# Altium project Noise Toaster.PrjPcb (part 1 of 3)
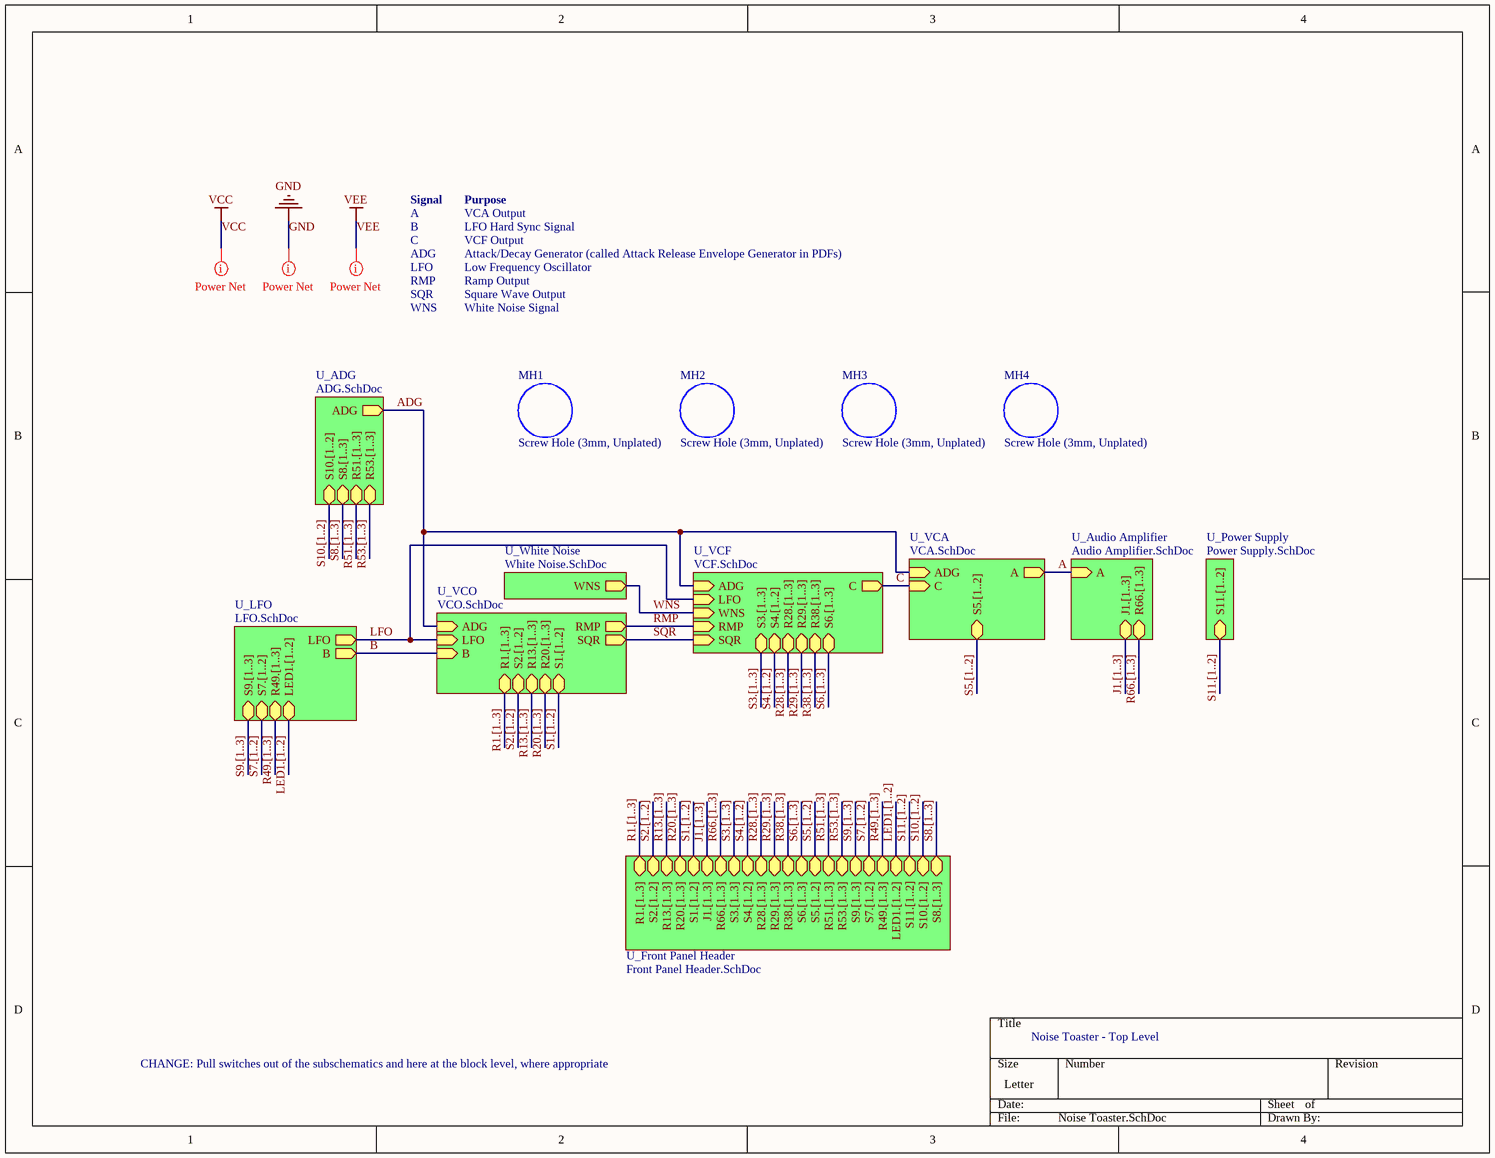
[diagram p0: Noise Toaster.SchDoc]
10 sheets, 135 parts. Net scope: hierarchical (ports join the sheet entries above them; power ports are global).
Board file: Noise Toaster.PcbDoc
Sheets:
  Noise Toaster.SchDoc
    U_Power Supply = Power Supply.SchDoc
    U_White Noise = White Noise.SchDoc
    U_LFO = LFO.SchDoc
    U_ADG = ADG.SchDoc
    U_Audio Amplifier = Audio Amplifier.SchDoc
    U_VCO = VCO.SchDoc
    U_VCF = VCF.SchDoc
    U_VCA = VCA.SchDoc
    U_Front Panel Header = Front Panel Header.SchDoc

## Sheet Noise Toaster.SchDoc: Noise Toaster - Top Level
size Letter; SheetNumber: 1; SheetTotal: 10

### Parts
MH1  Screw Hole (3mm, Unplated)  [SCREW HOLE (3MM, UNPLATED)]
MH2  Screw Hole (3mm, Unplated)  [SCREW HOLE (3MM, UNPLATED)]
MH3  Screw Hole (3mm, Unplated)  [SCREW HOLE (3MM, UNPLATED)]
MH4  Screw Hole (3mm, Unplated)  [SCREW HOLE (3MM, UNPLATED)]

### Sub-sheets
U_ADG = ADG.SchDoc: ADG (out), S10.[1..2] (bidir), S8.[1..3] (bidir), R51.[1..3] (bidir), R53.[1..3] (bidir)
U_Audio Amplifier = Audio Amplifier.SchDoc: A (in), J1.[1..3] (bidir), R66.[1..3] (bidir)
U_Front Panel Header = Front Panel Header.SchDoc: S5.[1..2] (bidir), R1.[1..3] (bidir), S2.[1..2] (bidir), R13.[1..3] (bidir), R20.[1..3] (bidir), S1.[1..2] (bidir), J1.[1..3] (bidir), R66.[1..3] (bidir), S3.[1..3] (bidir), S4.[1..2] (bidir), R28.[1..3] (bidir), R29.[1..3] (bidir), R38.[1..3] (bidir), S6.[1..3] (bidir), R51.[1..3] (bidir), R53.[1..3] (bidir), S9.[1..3] (bidir), S7.[1..2] (bidir), R49.[1..3] (bidir), LED1.[1..2] (bidir), S11.[1..2] (bidir), S10.[1..2] (bidir), S8.[1..3] (bidir)
U_LFO = LFO.SchDoc: LFO (out), B (out), S9.[1..3] (bidir), S7.[1..2] (bidir), R49.[1..3] (bidir), LED1.[1..2] (bidir)
U_Power Supply = Power Supply.SchDoc: S11.[1..2] (bidir)
U_VCA = VCA.SchDoc: A (out), C (in), ADG (in), S5.[1..2] (bidir)
U_VCF = VCF.SchDoc: SQR (in), RMP (in), WNS (in), LFO (in), ADG (in), C (out), S3.[1..3] (bidir), S4.[1..2] (bidir), R28.[1..3] (bidir), R29.[1..3] (bidir), R38.[1..3] (bidir), S6.[1..3] (bidir)
U_VCO = VCO.SchDoc: LFO (in), ADG (in), B (in), RMP (out), SQR (out), R1.[1..3] (bidir), S2.[1..2] (bidir), R13.[1..3] (bidir), R20.[1..3] (bidir), S1.[1..2] (bidir)
U_White Noise = White Noise.SchDoc: WNS (out)

### Nets
A: sheet U_Audio Amplifier/A, sheet U_VCA/A
ADG: sheet U_ADG/ADG, sheet U_VCO/ADG, sheet U_VCF/ADG, sheet U_VCA/ADG
B: sheet U_LFO/B, sheet U_VCO/B
C: sheet U_VCF/C, sheet U_VCA/C
LFO: sheet U_LFO/LFO, sheet U_VCO/LFO, sheet U_VCF/LFO
RMP: sheet U_VCO/RMP, sheet U_VCF/RMP
SQR: sheet U_VCO/SQR, sheet U_VCF/SQR  [project net S3.3]
WNS: sheet U_White Noise/WNS, sheet U_VCF/WNS  [project net S4.1]

### Buses and harness runs
bus J1.[1..3] = sheet U_Audio Amplifier/J1.[1..3]
bus J1.[1..3] = sheet U_Front Panel Header/J1.[1..3]
bus LED1.[1..2] = sheet U_Front Panel Header/LED1.[1..2]
bus LED1.[1..2] = sheet U_LFO/LED1.[1..2]
bus R1.[1..3] = sheet U_Front Panel Header/R1.[1..3]
bus R1.[1..3] = sheet U_VCO/R1.[1..3]
bus R13.[1..3] = sheet U_Front Panel Header/R13.[1..3]
bus R13.[1..3] = sheet U_VCO/R13.[1..3]
bus R20.[1..3] = sheet U_Front Panel Header/R20.[1..3]
bus R20.[1..3] = sheet U_VCO/R20.[1..3]
bus R28.[1..3] = sheet U_Front Panel Header/R28.[1..3]
bus R28.[1..3] = sheet U_VCF/R28.[1..3]
bus R29.[1..3] = sheet U_Front Panel Header/R29.[1..3]
bus R29.[1..3] = sheet U_VCF/R29.[1..3]
bus R38.[1..3] = sheet U_Front Panel Header/R38.[1..3]
bus R38.[1..3] = sheet U_VCF/R38.[1..3]
bus R49.[1..3] = sheet U_Front Panel Header/R49.[1..3]
bus R49.[1..3] = sheet U_LFO/R49.[1..3]
bus R51.[1..3] = sheet U_ADG/R51.[1..3]
bus R51.[1..3] = sheet U_Front Panel Header/R51.[1..3]
bus R53.[1..3] = sheet U_ADG/R53.[1..3]
bus R53.[1..3] = sheet U_Front Panel Header/R53.[1..3]
bus R66.[1..3] = sheet U_Audio Amplifier/R66.[1..3]
bus R66.[1..3] = sheet U_Front Panel Header/R66.[1..3]
bus S1.[1..2] = sheet U_Front Panel Header/S1.[1..2]
bus S1.[1..2] = sheet U_VCO/S1.[1..2]
bus S2.[1..2] = sheet U_Front Panel Header/S2.[1..2]
bus S2.[1..2] = sheet U_VCO/S2.[1..2]
bus S3.[1..3] = sheet U_Front Panel Header/S3.[1..3]
bus S3.[1..3] = sheet U_VCF/S3.[1..3]
bus S4.[1..2] = sheet U_Front Panel Header/S4.[1..2]
bus S4.[1..2] = sheet U_VCF/S4.[1..2]
bus S5.[1..2] = sheet U_Front Panel Header/S5.[1..2]
bus S5.[1..2] = sheet U_VCA/S5.[1..2]
bus S6.[1..3] = sheet U_Front Panel Header/S6.[1..3]
bus S6.[1..3] = sheet U_VCF/S6.[1..3]
bus S7.[1..2] = sheet U_Front Panel Header/S7.[1..2]
bus S7.[1..2] = sheet U_LFO/S7.[1..2]
bus S8.[1..3] = sheet U_ADG/S8.[1..3]
bus S8.[1..3] = sheet U_Front Panel Header/S8.[1..3]
bus S9.[1..3] = sheet U_Front Panel Header/S9.[1..3]
bus S9.[1..3] = sheet U_LFO/S9.[1..3]
bus S10.[1..2] = sheet U_ADG/S10.[1..2]
bus S10.[1..2] = sheet U_Front Panel Header/S10.[1..2]
bus S11.[1..2] = sheet U_Front Panel Header/S11.[1..2]
bus S11.[1..2] = sheet U_Power Supply/S11.[1..2]

### Layout directives
net class POWER; rule Width Constraint [Pref Width = 20mil    Min Width = 10mil    Max Width = 20mil]: GND, VCC, VEE

### Notes on the sheet
- Signal
- A
- B
- Purpose
- VCA Output
- LFO Hard Sync Signal
- C
- ADG
- LFO
- RMP
- SQR
- VCF Output
- Attack/Decay Generator (called Attack Release Envelope Generator in PDFs)
- Low Frequency Oscillator
- Ramp Output
- Square Wave Output
- WNS
- White Noise Signal
- CHANGE: Pull switches out of the subschematics and here at the block level, where appropriate

### Library data of the parts
MH1-MH4 = Screw Hole (3mm, Unplated): 3mm unplated plus washer keepout

## Sheet Power Supply.SchDoc: Power Supply
size Letter; SheetNumber: 6; SheetTotal: 10
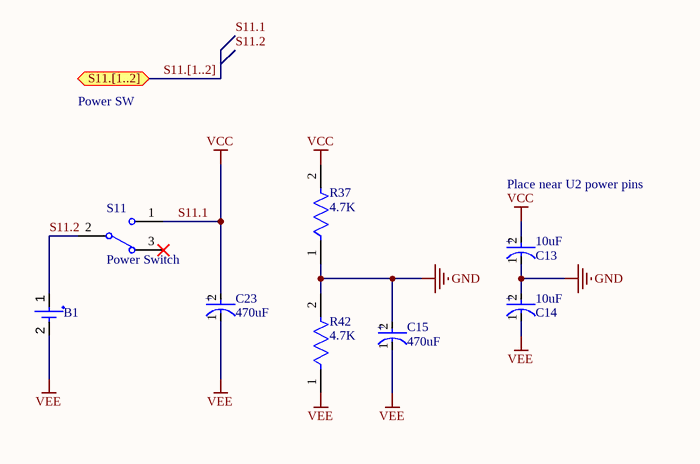
[diagram p1: Power Supply.SchDoc]

### Parts
B1  (no value)  [HDR1X2]
C13  Capacitance: 10uF  [FP-OS-CON-SMT-A5-MFG]  (hidden comment: 865080440002)
C14  Capacitance: 10uF  [FP-OS-CON-SMT-A5-MFG]  (hidden comment: 865080440002)
C15  Capacitance: 470uF  [FP-FTF-MFG]
C23  Capacitance: 470uF  [FP-FTF-MFG]
R37  Resistance: 4.7K  [FP-ESR03-IPC_B]  (hidden comment: ESR03EZPJ472)
R42  Resistance: 4.7K  [FP-ESR03-IPC_B]  (hidden comment: ESR03EZPJ472)
S11  Power Switch  [HDR1X3]

### Ports
S11.[1..2] (bidir)

### Nets
GND: C13.1(C) C14.2(A) C15.2(A) R37.1 R42.2
VCC: C13.2(A) C23.2(A) R37.2 S11.1  [also labelled S11.1]
VEE: B1.2(-) C14.1(C) C15.1(C) C23.1(C) R42.1
S11.2: B1.1(+) S11.2

Not connected (* = marked no-connect by the designer): S11 3*

### Buses and harness runs
bus S11.[1..2] = port S11.[1..2]

### Notes on the sheet
- Power SW
- (near C13) Place near U2 power pins
- Labels drawn without touching a wire or pin: S11.1, S11.2
- (in symbol CMP-05427-000040-1) +
- (in symbol CMP-05427-000158-1) +

### Library data of the parts
B1 = CMP-00622-2: Hldr, Battery, PP3 (6R61), Phospher Bronze, Tin, Panel Mount, 1, Solder Lug; Manufacturer: Bulgin; Manufacturer Part Number: BX0023; Body Material: Nylon,Glass,Bronze; Number of Cells: 1; Supplier 1: Arrow Electronics; Supplier Part Number 1: BX0023; RoHS: Yes; Category: Batteries and Accessories; Stock 1: 80; Pricing 1: 1=11.73100, 10=9.42900, 50=8.50000, 100=7.93600, 250=7.25000, 500=6.86300, 1000=6.28900 (USD); Mount: Panel,Screw; Contact Material: Bronze,Tin; Contact Plating: Tin; Material: Nylon,Glass; Min Operating Temperature: -30°C; Max Operating Temperature: 70°C; Package Quantity: 50; Termination: Solder; Number of Batteries: 1; Packaging: Bulk; Series: BX; REACH SVHC: No SVHC; Flammability Rating: UL94 V-0; RoHS Compliant: Yes; ComponentLink1URL: https://datasheet.ciiva.com/1390/bulgin-2010-p9-1390970.pdf?src-supplier=Element14; ComponentLink1Description: https://datasheet.ciiva.com/1390/bulgin-2010-p9-1390970.pdf?src-supplier=Element14; ComponentLink2URL: https://datasheet.ciiva.com/11714/0900766b80d05969-11714722.pdf?src-supplier=RSComponents; ComponentLink2Description: https://datasheet.ciiva.com/11714/0900766b80d05969-11714722.pdf?src-supplier=RSComponents; ComponentLink3URL: https://datasheet.ciiva.com/3/battholders-2010-3898.pdf?src-supplier=Digi-Key; ComponentLink3Description: https://datasheet.ciiva.com/3/battholders-2010-3898.pdf?src-supplier=Digi-Key; ComponentLink4URL: https://datasheet.ciiva.com/3353/06951396-3353149.pdf?src-supplier=Distrelec; ComponentLink4Description: https://datasheet.ciiva.com/3353/06951396-3353149.pdf?src-supplier=Distrelec; ComponentLink5URL: https://datasheet.ciiva.com/25759/70099004-25759926.pdf?src-supplier=Allied+Electronics; ComponentLink5Description: https://datasheet.ciiva.com/25759/70099004-25759926.pdf?src-supplier=Allied+Electronics; ComponentLink6URL: https://datasheet.ciiva.com/24336/battholders2005-24336774.pdf?src-supplier=Onlinecomponents.com; ComponentLink6Description: https://datasheet.ciiva.com/24336/battholders2005-24336774.pdf?src-supplier=Onlinecomponents.com
C13 C14 = CMP-05427-000158-1: CAP ALUM POLY 10UF 20% 10V SMD; Manufacturer: Wurth Electronics; Voltage Rating: 25V; Polarity: Polar; Ripple Current: 85mA; Impedance: 2.1R; Life (Hours): 2000Hour; Supplier 1: RSComponents; Supplier Part Number 1: 8391799P; Manufacturer Part Number: 865080440002; RoHS: Yes; Category: Aluminum Electrolytic Capacitors; Stock 1: 1; Pricing 1: 25=0.18500, 125=0.12700, 250=0.11600, 500=0.10400 (USD); Mount: Surface Mount; Case/Package: Radial; Min Operating Temperature: -55°C; Max Operating Temperature: 105°C; Package Quantity: 2000; Packaging: Cut Tape; Ripple Current (AC): 85mA; Tolerance: 20%; Voltage Rating (DC): 25V; Diameter: 4mm; Height: 5.5mm; Height - Seated (Max): 0.217inch; REACH SVHC: Unknown; RoHS Compliant: Yes; ComponentLink1URL: http://www.farnell.com/datasheets/1880137.pdf?src-supplier=Farnell; ComponentLink1Description: http://www.farnell.com/datasheets/1880137.pdf?src-supplier=Farnell; ComponentLink2URL: http://www.farnell.com/datasheets/1880137.pdf?src-supplier=Element14; ComponentLink2Description: http://www.farnell.com/datasheets/1880137.pdf?src-supplier=Element14; ComponentLink3URL: https://katalog.we-online.de/pbs/datasheet/865080440002.pdf?src-supplier=Digi-Key; ComponentLink3Description: https://katalog.we-online.de/pbs/datasheet/865080440002.pdf?src-supplier=Digi-Key; ComponentLink4URL: http://katalog.we-online.de/pbs/datasheet/865080440002.pdf?src-supplier=Digi-Key; ComponentLink4Description: http://katalog.we-online.de/pbs/datasheet/865080440002.pdf?src-supplier=Digi-Key
C15 C23 = CMP-05427-000040-1: Manufacturer: Wurth Electronics; Manufacturer Part Number: 865080353015; Voltage Rating: 16V; Polarity: Polar; Ripple Current: 590mA; Impedance: 220mR; Life (Hours): 2000Hour; Tolerance: 20%; Supplier 1: Digi-Key; Supplier Part Number 1: 732-8425-1-ND; RoHS: Yes; Category: Aluminum Electrolytic Capacitors; Stock 1: 263; Pricing 1: 1=0.63000, 50=0.53700, 100=0.46700, 250=0.41600 (USD); Mount: Surface Mount; Case/Package: Radial; Min Operating Temperature: -55°C; Max Operating Temperature: 105°C; Package Quantity: 500; Packaging: Cut Tape; Ripple Current (AC): 590mA; Voltage Rating (DC): 16V; Diameter: 8mm; Height: 10.5mm; Height - Seated (Max): 0.413inch; REACH SVHC: Unknown; RoHS Compliant: Yes; ComponentLink1URL: http://www.farnell.com/datasheets/1880132.pdf?src-supplier=Farnell; ComponentLink1Description: http://www.farnell.com/datasheets/1880132.pdf?src-supplier=Farnell; ComponentLink2URL: http://www.farnell.com/datasheets/1880132.pdf?src-supplier=Element14; ComponentLink2Description: http://www.farnell.com/datasheets/1880132.pdf?src-supplier=Element14; ComponentLink3URL: https://katalog.we-online.de/pbs/datasheet/865080353015.pdf?src-supplier=Digi-Key; ComponentLink3Description: https://katalog.we-online.de/pbs/datasheet/865080353015.pdf?src-supplier=Digi-Key; ComponentLink4URL: http://katalog.we-online.de/pbs/datasheet/865080353015.pdf?src-supplier=Digi-Key; ComponentLink4Description: http://katalog.we-online.de/pbs/datasheet/865080353015.pdf?src-supplier=Digi-Key
R37 R42 = CMP-08839-007853-1: 4.7kΩ ±5% 0.25W 0603 Anti-Surge Chip Resistor AEC-Q200; Max Power Dissipation: 250mW; Temperature Coefficient: 200ppm/°C; Packaging: Tape and Reel; Series: ESR; Height: 0.022inch; Case Code (Imperial): 0603; Tolerance: 5%; RoHS Compliant: Yes; Case/Package: 0603; Min Operating Temperature: -55°C; Resistor Type: Thick Film; Package Quantity: 5000; Features: Automotive AEC-Q200; Width: 0.031inch; Length: 0.063inch; Max Operating Temperature: 155°C; Number of Terminations: 2
S11 = SW-SPDT: Switch Toggle ON None ON SPDT Round Lever Solder Lug 5A 250VAC 28VDC Panel Mount with Threads; Manufacturer: E-Switch; Manufacturer Part Number: 100SP1T1B1M1QEH; Actuator Material: Brass,Chrome; Actuator Color: Chrome; Voltage Rating (AC): 120V; Voltage Rating (DC): 28V; Max Voltage Rating (AC): 250V; Illumination Type: Illuminated,Non-Illuminated; Switch Function: On-On; Actuator Type: Standard Round; Contact Resistance: 100mR; Electrical Life: 40000Cycles; Actuator Length: 10.41mm; Supplier 1: Newark; Supplier Part Number 1: 15N9971; RoHS: Yes; Category: Toggle Switches; Stock 1: 978; Pricing 1: 1=3.08000, 10=2.76000, 25=2.61000, 50=2.49000, 100=2.37000 (USD); Mount: Panel; Contact Material: Copper Alloy,Silver; Contact Plating: Silver; Housing Material: Stainless Steel; Min Operating Temperature: -30°C; Max Operating Temperature: 85°C; Throw Configuration: SPDT; Current Rating: 5A; Package Quantity: 1; Packaging: Bulk; Max Voltage Rating (DC): 28V; Termination: Solder; Orientation: Straight; Series: 100; REACH SVHC: No SVHC; Lead Free: Lead Free; RoHS Compliant: Yes; ComponentLink1URL: https://datasheet.ciiva.com/2904/st110007c-2904798.pdf?src-supplier=Digi-Key; ComponentLink1Description: https://datasheet.ciiva.com/2904/st110007c-2904798.pdf?src-supplier=Digi-Key; ComponentLink2URL: https://datasheet.ciiva.com/16154/xt0157p-16154561.pdf?src-supplier=Onlinecomponents.com; ComponentLink2Description: https://datasheet.ciiva.com/16154/xt0157p-16154561.pdf?src-supplier=Onlinecomponents.com; ComponentLink3URL: https://datasheet.ciiva.com/16347/100-16347391.pdf?src-supplier=Future+Electronics; ComponentLink3Description: https://datasheet.ciiva.com/16347/100-16347391.pdf?src-supplier=Future+Electronics

## Sheet White Noise.SchDoc: White Noise Generator
size Letter; SheetNumber: 10; SheetTotal: 10
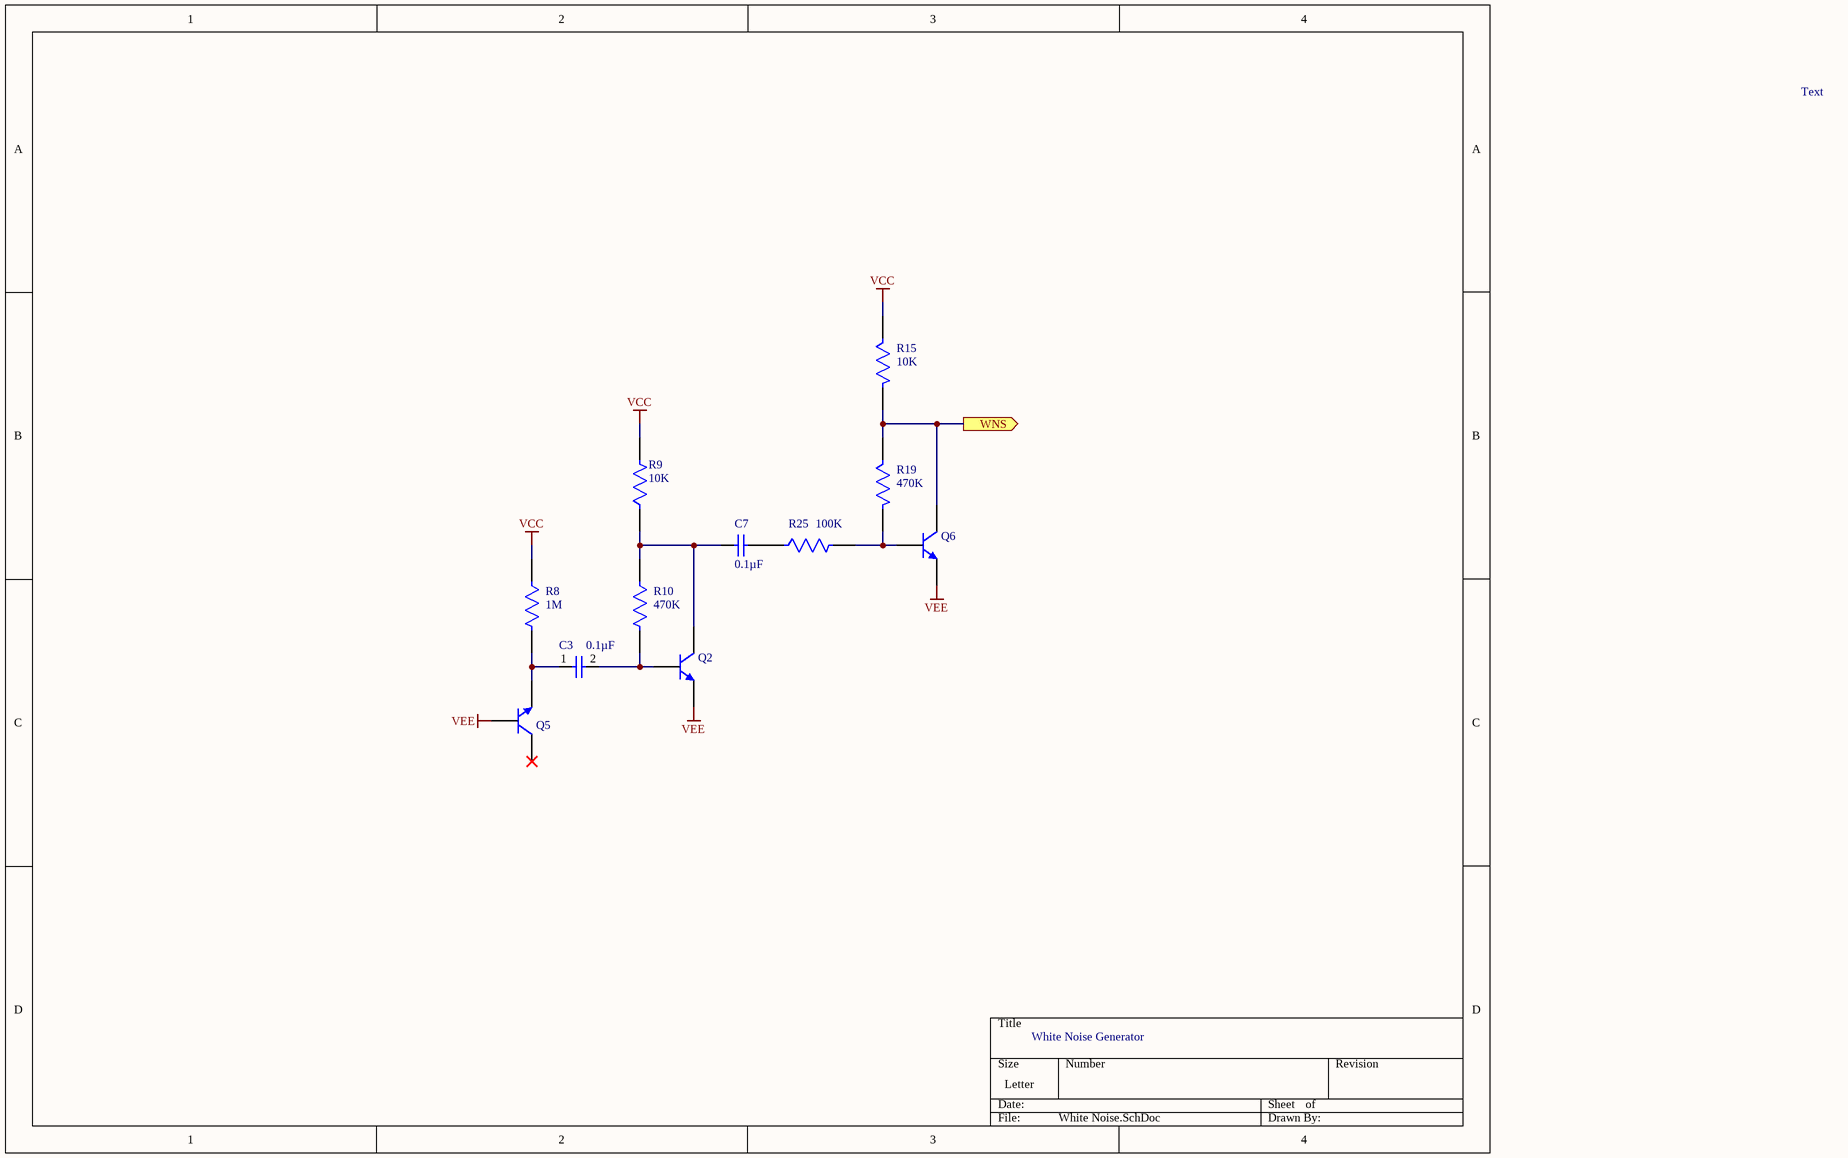
[diagram p2: White Noise.SchDoc]

### Parts
C3  Capacitance: 0.1µF  [SAMS-C0603-2_M]  (hidden comment: CL10B104KB8NNNC)
C7  Capacitance: 0.1µF  [SAMS-C0603-2_M]  (hidden comment: CL10B104KB8NNNC)
Q2  MMBT3904LT1G  [ONSC-SOT-23-3-318-08_V]  (value not drawn)
Q5  MMBT3904LT1G  [ONSC-SOT-23-3-318-08_V]  (value not drawn)
Q6  MMBT3904LT1G  [ONSC-SOT-23-3-318-08_V]  (value not drawn)
R8  Resistance: 1M  [FP-ESR03-IPC_B]  (hidden comment: ESR03EZPJ105)
R9  Resistance: 10K  [FP-ESR03-IPC_B]  (hidden comment: ESR03EZPJ103)
R10  Resistance: 470K  [FP-ESR03-IPC_B]  (hidden comment: ESR03EZPJ474)
R15  Resistance: 10K  [FP-ESR03-IPC_B]  (hidden comment: ESR03EZPJ103)
R19  Resistance: 470K  [FP-ESR03-IPC_B]  (hidden comment: ESR03EZPJ474)
R25  Resistance: 100K  [FP-ESR03-IPC_B]  (hidden comment: ESR03EZPJ104)

### Ports
WNS (out)

### Nets
VCC: R8.1 R9.2 R15.1
VEE: Q2.2(E) Q5.1(B) Q6.2(E)
S4.1: Q6.3(C) R15.2 R19.1 ; port WNS
NetC3_1: C3.1 Q5.2(E) R8.2
NetC3_2: C3.2 Q2.1(B) R10.2
NetC7_1: C7.1 R25.1
NetC7_2: C7.2 Q2.3(C) R9.1 R10.1
NetQ6_1: Q6.1(B) R19.2 R25.2

Not connected (* = marked no-connect by the designer): Q5 3(C)*

### Notes on the sheet
- Text

### Library data of the parts
C3 C7 = CMP-2000-05332-1: Multi-layer Ceramic Capacitor, -55 to 125 degC, 2-Pin SMD (0603), RoHS, Tape and Reel; Manufacturer: Samsung Electro-Mechanics; Rated Voltage: 50V; Dielectric: X7R; Tolerance (%): ±10%; Case Size/Dimension: 0603; Datasheet URL: https://datasheet.ciiva.com/29198/456651-da-01-en-vs-kondensator-0605-29198839.pdf; Manufacturer URL: http://www.samsungsem.com/global/index.jsp; Datasheet Version: Nov-10
Q2 Q5 Q6 = CMP-1048-00631-1: General Purpose Transistor, NPN Silicon, 3-Pin SOT-23, Pb-Free, Tape and Reel; Manufacturer: On Semiconductor; Manufacturer Part Number: MMBT3904,215; IC Continuous (A): 0.2; fT Min (MHz): 300; ComponentLink2Description: Datasheet; Polarity: NPN; PackageDescription: 3-Pin Small Outline Transistor, Body 2.92 x 1.3 mm, Pitch 0.95 mm; ComponentLink2URL: http://www.onsemi.cn/pub_link/Collateral/MMBT3904LT1-D.PDF; DatasheetVersion: Rev. 12; Mounting Technology: Surface Mount; PartNumber: MMBT3904LT1G; ComponentLink1URL: http://www.onsemi.com/; ComponentLink3Description: Package Specification; ComponentLink1Description: Manufacturer URL; PackageVersion: Rev. AP, 11/2009; PackageReference: SOT-23-3-318-08; Packing: Tape and Reel; ComponentLink3URL: http://www.onsemi.cn/pub_link/Collateral/318-08.PDF; RoHS: TRUE; Supplier 1: Digi-Key; Supplier Part Number 1: 1727-4044-1-ND; Category: BJTs; Stock 1: 165643; Pricing 1: 1=0.10000, 10=0.06500, 25=0.06200, 100=0.03500, 500=0.02750, 1000=0.01910 (USD); RoHS Compliant: Yes; ComponentLink4URL: http://www.farnell.com/datasheets/2328888.pdf?src-supplier=Farnell; ComponentLink4Description: http://www.farnell.com/datasheets/2328888.pdf?src-supplier=Farnell; ComponentLink5URL: https://assets.nexperia.com/documents/data-sheet/MMBT3904.pdf?src-supplier=Digi-Key; ComponentLink5Description: https://assets.nexperia.com/documents/data-sheet/MMBT3904.pdf?src-supplier=Digi-Key; ComponentLink6URL: http://www.farnell.com/datasheets/2328888.pdf?src-supplier=Newark; ComponentLink6Description: http://www.farnell.com/datasheets/2328888.pdf?src-supplier=Newark
R8 = CMP-08839-029147-1: 1MΩ ±5% 0.25W 0603 Anti-Surge Chip Resistor AEC-Q200; Max Power Dissipation: 250mW; Temperature Coefficient: 200ppm/°C; Width: 0.031inch; Package Quantity: 1; Case/Package: 0603; Features: Automotive AEC-Q200; Packaging: Cut Tape; Case Code (Metric): 1608; Number of Terminations: 2; Series: ESR; Max Operating Temperature: 155°C; Resistor Type: Thick Film; RoHS Compliant: Yes; Min Operating Temperature: -55°C; Height: 0.022inch; Length: 0.063inch; Tolerance: 5%; Case Code (Imperial): 0603
R9 R15 = CMP-08839-028975-1: 10kΩ ±5% 0.25W 0603 Anti-Surge Chip Resistor AEC-Q200; Power Rating: 250mW; Temperature Coefficient: 200ppm/°C; Tolerance: 5%; Series: ESR03; Package Quantity: 5000; Length: 0.063inch; Height: 0.022inch; Lead Free: Lead Free; Case/Package: 0603; Case Code (Metric): 1608; Width: 0.031inch; Resistor Type: Thick Film; Max Power Dissipation: 250mW; Packaging: Tape and Reel; Mount: Surface Mount; Number of Terminations: 2; Case Code (Imperial): 0603; Max Operating Temperature: 155°C; Min Operating Temperature: -55°C; RoHS Compliant: Yes
R10 R19 = CMP-08839-028761-1: 470kΩ ±5% 0.25W 0603 Anti-Surge Chip Resistor AEC-Q200; Temperature Coefficient: 200ppm/°C; Max Power Dissipation: 250mW; RoHS Compliant: Yes; Packaging: Cut Tape; Max Operating Temperature: 155°C; Package Quantity: 5000; Resistor Type: Thick Film; Min Operating Temperature: -55°C; Number of Terminations: 2; Features: Automotive AEC-Q200; Tolerance: 5%; Width: 0.031inch; Case Code (Metric): 1608; Length: 0.063inch; Case/Package: 0603; Height: 0.022inch; Case Code (Imperial): 0603; Series: ESR
R25 = CMP-08839-029521-1: 100kΩ ±5% 0.25W 0603 Anti-Surge Chip Resistor AEC-Q200; Power Rating: 200mW; Max Power Dissipation: 250mW; Temperature Coefficient: 200ppm/°C; Length: 0.063inch; Case Code (Imperial): 0603; Case/Package: 0603; Resistor Type: Thick Film; Features: Automotive AEC-Q200; Package Quantity: 1; Width: 0.031inch; Packaging: Cut Tape; Min Operating Temperature: -55°C; Series: ESR; RoHS Compliant: Yes; Size Code: 0603; Tolerance: 5%; Height: 0.022inch; Max Operating Temperature: 155°C; Lead Free: Lead Free; Case Code (Metric): 1608; Number of Terminations: 2

## Sheet LFO.SchDoc: Low Frequency Oscillator
size Letter; SheetNumber: 5; SheetTotal: 10
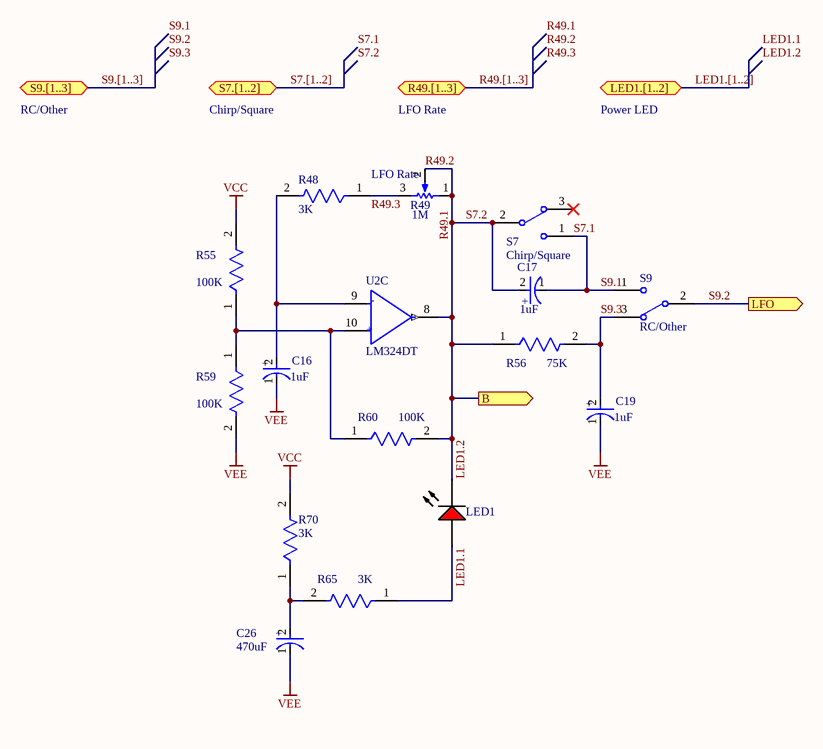
[diagram p3: LFO.SchDoc]

### Parts
C16  Capacitance: 1uF  [FP-OS-CON-SMT-A5-MFG]  (hidden comment: ‎865060640001‎)
C17  Capacitance: 1uF  [FP-OS-CON-SMT-A5-MFG]  (hidden comment: EEE-1HA010NR)
C19  Capacitance: 1uF  [FP-OS-CON-SMT-A5-MFG]  (hidden comment: ‎865060640001‎)
C26  Capacitance: 470uF  [FP-FTF-MFG]
LED1  C503B-RAN-CY0B0AA2  [CREE-C503B-RAN]  (value not drawn)  (graphical)
R48  Resistance: 3K  [FP-ESR03-IPC_B]  (hidden comment: ESR03EZPJ302)
R49  LFO Rate  value 1M  [VR5]  (graphical)
R55  Resistance: 100K  [FP-ESR03-IPC_B]  (hidden comment: ESR03EZPJ104)
R56  Resistance: 75K  [FP-ESR03-IPC_B]  (hidden comment: ESR03EZPJ753)
R59  Resistance: 100K  [FP-ESR03-IPC_B]  (hidden comment: ESR03EZPJ104)
R60  Resistance: 100K  [FP-ESR03-IPC_B]  (hidden comment: ESR03EZPJ104)
R65  Resistance: 3K  [FP-ESR03-IPC_B]  (hidden comment: ESR03EZPJ302)
R70  Resistance: 3K  [FP-ESR03-IPC_B]  (hidden comment: ESR03EZPJ302)
S7  Chirp/Square  [HDR1X3]
S9  RC/Other  [HDR1X3]  (graphical)
U2  LM324DT  [FP-SO-14-MFG]  (part C of 4)

### Ports
B (out), LED1.[1..2] (bidir), LFO (out), R49.[1..3] (bidir), S7.[1..2] (bidir), S9.[1..3] (bidir)

### Nets
VCC: R55.2 R70.2
VEE: C16.1(C) C19.1(C) C26.1(C) R59.2
LED1.1: LED1.1(A) R65.1
LED1.2: C17.2(A) LED1.2(K) R49.1(TOP) R49.2(TAP) R56.1 R60.2 S7.2 U2.8(Output_3) ; port B  [also labelled R49.1, R49.2, S7.2]  [project net B]
R49.3: R48.1 R49.3(BOT)
S7.1: C17.1(C) S7.1 S9.1  [also labelled S9.1]
S9.2: S9.2 ; port LFO  [project net LFO]
S9.3: C19.2(A) R56.2 S9.3
NetC16_2: C16.2(A) R48.2 U2.9(Inverting_Input_3)
NetC26_2: C26.2(A) R65.2 R70.1
NetR55_1: R55.1 R59.1 R60.1 U2.10(Non-Inverting_Input_3)

Not connected (* = marked no-connect by the designer): S7 3*

### Buses and harness runs
bus LED1.[1..2] = port LED1.[1..2]
bus R49.[1..3] = port R49.[1..3]
bus S7.[1..2] = port S7.[1..2]
bus S9.[1..3] = port S9.[1..3]

### Notes on the sheet
- RC/Other
- Chirp/Square
- LFO Rate
- Power LED
- Labels drawn without touching a wire or pin: LED1.1, LED1.2, R49.1, R49.2, R49.3, S7.1, S7.2, S9.1, S9.2, S9.3
- (in symbol CMP-05427-000040-1) +
- (in symbol CMP-05427-000158-1) +
- (in symbol CMP-12131-000005-1, part C) -; +

### Library data of the parts
C16 C19 = CMP-05427-000158-1: Manufacturer: Wurth Electronics; Voltage Rating: 50V; Polarity: Polar; Ripple Current: 60mA; Impedance: 2.9R; Life (Hours): 2000Hour; Tolerance: 20%; Supplier 1: RSComponents; Supplier Part Number 1: 8395602; Manufacturer Part Number: 865060640001; RoHS: Yes; Category: Aluminum Electrolytic Capacitors; Stock 1: 1; Pricing 1: 25=0.16200, 125=0.11600, 250=0.10400, 500=0.09300 (USD); Mount: Surface Mount; Case/Package: Radial; Min Operating Temperature: -55°C; Max Operating Temperature: 105°C; Package Quantity: 2000; Packaging: Cut Tape; Ripple Current (AC): 60mA; Voltage Rating (DC): 50V; Diameter: 4mm; Height: 5.5mm; Height - Seated (Max): 0.217inch; REACH SVHC: Unknown; ComponentLink1URL: http://www.farnell.com/datasheets/1880069.pdf?src-supplier=Farnell; ComponentLink1Description: http://www.farnell.com/datasheets/1880069.pdf?src-supplier=Farnell; ComponentLink2URL: http://www.farnell.com/datasheets/1880069.pdf?src-supplier=Element14; ComponentLink2Description: http://www.farnell.com/datasheets/1880069.pdf?src-supplier=Element14; ComponentLink3URL: http://www.farnell.com/datasheets/1880069.pdf?src-supplier=Newark; ComponentLink3Description: http://www.farnell.com/datasheets/1880069.pdf?src-supplier=Newark; ComponentLink4URL: http://katalog.we-online.de/pbs/datasheet/865060640001.pdf?src-supplier=Digi-Key; ComponentLink4Description: http://katalog.we-online.de/pbs/datasheet/865060640001.pdf?src-supplier=Digi-Key; ComponentLink5URL: https://katalog.we-online.de/pbs/datasheet/865060640001.pdf?src-supplier=Digi-Key; ComponentLink5Description: https://katalog.we-online.de/pbs/datasheet/865060640001.pdf?src-supplier=Digi-Key
C17 = CMP-05427-000158-1: CAP ALUM POLY 10UF 20% 10V SMD Non-Polarized; Manufacturer: Panasonic; Voltage Rating: 50V; Ripple Current: 10mA; Life (Hours): 2000Hour; ComponentLink1URL: https://datasheet.ciiva.com/24228/aba0000ce2-40801-24228231.pdf?src-supplier=Mouser; ComponentLink1Description: https://datasheet.ciiva.com/24228/aba0000ce2-40801-24228231.pdf?src-supplier=Mouser; ComponentLink2URL: https://datasheet.ciiva.com/14604/70255710-14604079.pdf?src-supplier=Allied+Electronics; ComponentLink2Description: https://datasheet.ciiva.com/14604/70255710-14604079.pdf?src-supplier=Allied+Electronics; ComponentLink3URL: https://datasheet.ciiva.com/14597/70255710-14597097.pdf?src-supplier=Allied+Electronics; ComponentLink3Description: https://datasheet.ciiva.com/14597/70255710-14597097.pdf?src-supplier=Allied+Electronics; ComponentLink4URL: https://datasheet.ciiva.com/16396/aba0000ce2-16396566.pdf?src-supplier=Future+Electronics; ComponentLink4Description: https://datasheet.ciiva.com/16396/aba0000ce2-16396566.pdf?src-supplier=Future+Electronics; ComponentLink5URL: https://datasheet.ciiva.com/30244/11aba0000ce2-30244199.pdf?src-supplier=Onlinecomponents.com; ComponentLink5Description: https://datasheet.ciiva.com/30244/11aba0000ce2-30244199.pdf?src-supplier=Onlinecomponents.com; Supplier 1: Mouser; Supplier Part Number 1: 667-EEE-1HA010NR; Manufacturer Part Number: EEE-1HA010NR; RoHS: Yes; Category: Aluminum Electrolytic Capacitors; Stock 1: 556; Pricing 1: 1=0.50000, 10=0.34500, 50=0.24200, 100=0.20700, 1000=0.15300, 10000=0.12100 (USD); Mount: Surface Mount,PCB; Case/Package: Radial; Contact Plating: Tin; Min Operating Temperature: -40°C; Max Operating Temperature: 85°C; Packaging: Tape and Reel; Tolerance: 20%; Voltage Rating (DC): 50V; Package Quantity: 1; Termination: SMD/SMT; Series: S; Construction: Cylindrical; Ripple Current (AC): 10mA; Diameter: 4mm; Length: 5.5mm; Width: 650um; Height: 5.4mm; Height - Seated (Max): 0.213inch; Radiation Hardening: No; RoHS Compliant: Yes; REACH SVHC: Unknown; Lead Free: Lead Free
C26 = CMP-05427-000040-1: as C15 on sheet Power Supply; Supplier 1: Digi-Key; Supplier Part Number 1: 732-8425-1-ND; RoHS: Yes; Category: Aluminum Electrolytic Capacitors; Stock 1: 263; Pricing 1: 1=0.63000, 50=0.53700, 100=0.46700, 250=0.41600 (USD); Mount: Surface Mount; Case/Package: Radial; Min Operating Temperature: -55°C; Max Operating Temperature: 105°C; Package Quantity: 500; Packaging: Cut Tape; Ripple Current (AC): 590mA; Voltage Rating (DC): 16V; Diameter: 8mm; Height: 10.5mm; Height - Seated (Max): 0.413inch; REACH SVHC: Unknown; RoHS Compliant: Yes; ComponentLink1URL: http://www.farnell.com/datasheets/1880132.pdf?src-supplier=Farnell; ComponentLink1Description: http://www.farnell.com/datasheets/1880132.pdf?src-supplier=Farnell; ComponentLink2URL: http://www.farnell.com/datasheets/1880132.pdf?src-supplier=Element14; ComponentLink2Description: http://www.farnell.com/datasheets/1880132.pdf?src-supplier=Element14; ComponentLink3URL: https://katalog.we-online.de/pbs/datasheet/865080353015.pdf?src-supplier=Digi-Key; ComponentLink3Description: https://katalog.we-online.de/pbs/datasheet/865080353015.pdf?src-supplier=Digi-Key; ComponentLink4URL: http://katalog.we-online.de/pbs/datasheet/865080353015.pdf?src-supplier=Digi-Key; ComponentLink4Description: http://katalog.we-online.de/pbs/datasheet/865080353015.pdf?src-supplier=Digi-Key
LED1 = CMP-2000-06058-1: Cree(R) 5-mm Red Round LED, 2.1 V, -40 to 100 degC, 2-Pin THD, RoHS, Ammo; Manufacturer Part Number: C503B-RAS-CA0C0AA1; Forward Current: 50mA; Product Depth (mm): 5.8mm; Power Dissipation: 130mW; Viewing Angle: 15°; Test Current (It): 20mA; Type: Uni-Color; Shape Type: Circular; Product Height (mm): 8.8mm; Luminous Intensity: 12000mcd; Main Category: StandardLED; Forward Voltage: 2.6V; Number of  Elements: 1; Dominant Wave Length: 624nm; Reverse Voltage: 5V; Lens Color: Colorless; Lens Style: Round,Domed; Lens Transparency: Clear; Lens Size: 5mm; Mounting Technology: ThroughHole; Datasheet Version: 12/2014; Manufacturer URL: http://www.cree.com/; Packaging: AmmoPack; Operating Temperature Classification: Industrial; Package Description: 2-Pin Through Hole Device, Dia 5.8 mm, Pitch 2.54 mm; Package Reference: C503B-RAN; Product Length (mm): 5.8mm; Datasheet URL: http://www.cree.com/sitecore-modules/web/~/media/Files/Cree/LED-Components-and-Modules/HB/Data-Sheets/C503B-RAS-RAN-AAS-AAN-RBS-RBN-ABS-ABN-RCS-RCN-ACS-ACN-1079.pdf; Operating Temp Range: -40Cto100C; Manufacturer: Cree; Mounting: ThroughHole; Emitting Color: Red; Lens Dimensions: 5x5x7.8mm; Package Type: T-13/4; Pin Count: 2; Supplier 1: Digi-Key; Supplier Part Number 1: C503B-RAS-CA0C0AA1-ND; RoHS: Yes; Category: LEDs; Stock 1: 3361; Pricing 1: 1=0.16000, 10=0.14500, 100=0.13420, 1000=0.12000, 50000=0.11143 (USD); Mount: Through Hole; Case/Package: Radial; Color: Red; Test Current: 20mA; Dominant Wavelength: 624nm; Height: 13.3mm; RoHS Compliant: Yes; ComponentLink1URL: https://www.cree.com/led-components/media/documents/C503B-RAS-RAN-AAS-AAN-RBS-RBN-ABS-ABN-RCS-RCN-ACS-ACN-1079.pdf?src-supplier=Digi-Key; ComponentLink1Description: https://www.cree.com/led-components/media/documents/C503B-RAS-RAN-AAS-AAN-RBS-RBN-ABS-ABN-RCS-RCN-ACS-ACN-1079.pdf?src-supplier=Digi-Key
R48 R65 R70 = CMP-08839-028498-1: 3kΩ ±5% 0.25W 0603 Anti-Surge Chip Resistor AEC-Q200; Temperature Coefficient: 200ppm/°C; Max Power Dissipation: 250mW; Package Quantity: 5000; Case/Package: 0603; Number of Terminations: 2; RoHS Compliant: Yes; Height: 0.022inch; Packaging: Tape and Reel; Min Operating Temperature: -55°C; Max Operating Temperature: 155°C; Series: ESR; Case Code (Metric): 1608; Features: Automotive AEC-Q200; Width: 0.031inch; Case Code (Imperial): 0603; Length: 0.063inch; Resistor Type: Thick Film; Tolerance: 5%
R49 = RPot: Potentiometer; Sim Note: Enter the Resistance value and the set point into parameter fields.; Set Position: 0.5; Published: 8-Jun-2000; LatestRevisionDate: 17-Jul-2002; LatestRevisionNote: Re-released for DXP Platform.; PackageReference: VR5; Publisher: Altium Limited; PackageDescription: Variable Resistor, Thru-Hole; 3 Leads
R55 R59 R60 = CMP-08839-029521-1: as R25 on sheet White Noise; Length: 0.063inch; Case Code (Imperial): 0603; Case/Package: 0603; Resistor Type: Thick Film; Features: Automotive AEC-Q200; Package Quantity: 1; Width: 0.031inch; Packaging: Cut Tape; Min Operating Temperature: -55°C; Series: ESR; RoHS Compliant: Yes; Size Code: 0603; Tolerance: 5%; Height: 0.022inch; Max Operating Temperature: 155°C; Lead Free: Lead Free; Case Code (Metric): 1608; Number of Terminations: 2
R56 = CMP-08839-028281-1: 75kΩ ±5% 0.25W 0603 Anti-Surge Chip Resistor AEC-Q200; Temperature Coefficient: 200ppm/°C; Max Power Dissipation: 250mW; Min Operating Temperature: -55°C; Number of Terminations: 2; Tolerance: 5%; Height: 0.022inch; Case Code (Metric): 1608; Width: 0.031inch; Case Code (Imperial): 0603; Package Quantity: 5000; Length: 0.063inch; Series: ESR; RoHS Compliant: Yes; Resistor Type: Thick Film; Packaging: Tape and Reel; Features: Automotive AEC-Q200; Max Operating Temperature: 155°C; Case/Package: 0603
S7 S9 = SW-SPDT: as S11 on sheet Power Supply; Supplier 1: Newark; Supplier Part Number 1: 15N9971; RoHS: Yes; Category: Toggle Switches; Stock 1: 978; Pricing 1: 1=3.08000, 10=2.76000, 25=2.61000, 50=2.49000, 100=2.37000 (USD); Mount: Panel; Contact Material: Copper Alloy,Silver; Contact Plating: Silver; Housing Material: Stainless Steel; Min Operating Temperature: -30°C; Max Operating Temperature: 85°C; Throw Configuration: SPDT; Current Rating: 5A; Package Quantity: 1; Packaging: Bulk; Max Voltage Rating (DC): 28V; Termination: Solder; Orientation: Straight; Series: 100; REACH SVHC: No SVHC; Lead Free: Lead Free; RoHS Compliant: Yes; ComponentLink1URL: https://datasheet.ciiva.com/2904/st110007c-2904798.pdf?src-supplier=Digi-Key; ComponentLink1Description: https://datasheet.ciiva.com/2904/st110007c-2904798.pdf?src-supplier=Digi-Key; ComponentLink2URL: https://datasheet.ciiva.com/16154/xt0157p-16154561.pdf?src-supplier=Onlinecomponents.com; ComponentLink2Description: https://datasheet.ciiva.com/16154/xt0157p-16154561.pdf?src-supplier=Onlinecomponents.com; ComponentLink3URL: https://datasheet.ciiva.com/16347/100-16347391.pdf?src-supplier=Future+Electronics; ComponentLink3Description: https://datasheet.ciiva.com/16347/100-16347391.pdf?src-supplier=Future+Electronics
U2 = CMP-12131-000005-1: IC OPAMP GP 4 CIRCUIT 14SO; Manufacturer: STMicroelectronics; Voltage Gain: 100dB; Standoff Height: 0.1mm; Bandwidth: 1.3MHz; Max Junction Temp: +150°C; Min Supply Voltage: 3V; Max Dual Supply Voltage: 15V; Min Dual Supply Voltage: 1.5V; Number Of Channels: 4; Nominal Supply Current: 0.7-1.5mA; Output Current Per Channel: 20-50mA; Max Supply Voltage: 30V; Input Offset Voltage: 2mV; Input Bias Current: 0.02uA; Device Class L1: Integrated Circuits (ICs); Device Class L3: Amplifiers - Op Amps; Temperature Range Low: 0°C; Package: SO-14; Temperature Range High: +70°C; Digikey Description: IC OPAMP GP 4 CIRCUIT 14SO; Device Class L2: Linear ICs; Footprint Url: https://www.st.com/content/ccc/resource/technical/document/datasheet/group3/10/8a/e6/12/f8/e8/49/ce/DM00366438/files/DM00366438.pdf/jcr:content/translations/en.DM00366438.pdf; Octopart: https://octopart.com/lm324dt-stmicroelectronics-39579146; ComponentLink2URL: https://www.st.com/content/ccc/resource/technical/document/datasheet/bd/fc/46/43/26/8f/40/7f/CD00001046.pdf/files/CD00001046.pdf/jcr:content/translations/en.CD00001046.pdf; ComponentLink2Description: Datasheet; Lead Free: Yes; Temperature: 0°C to +70°C; RoHS: TRUE; Gain Bandwidth: 1.3MHz; Manufacturer Part Number: LM324DT; Automotive: No; Category: IC; Height: 1.75mm; Mouser Description: LM324 Series 32 V 1.3 MHz Low Power Quad Operational Amplifier - SOIC-14

## Sheet ADG.SchDoc: Attack Decay Generator
size Letter; SheetNumber: 3; SheetTotal: 10
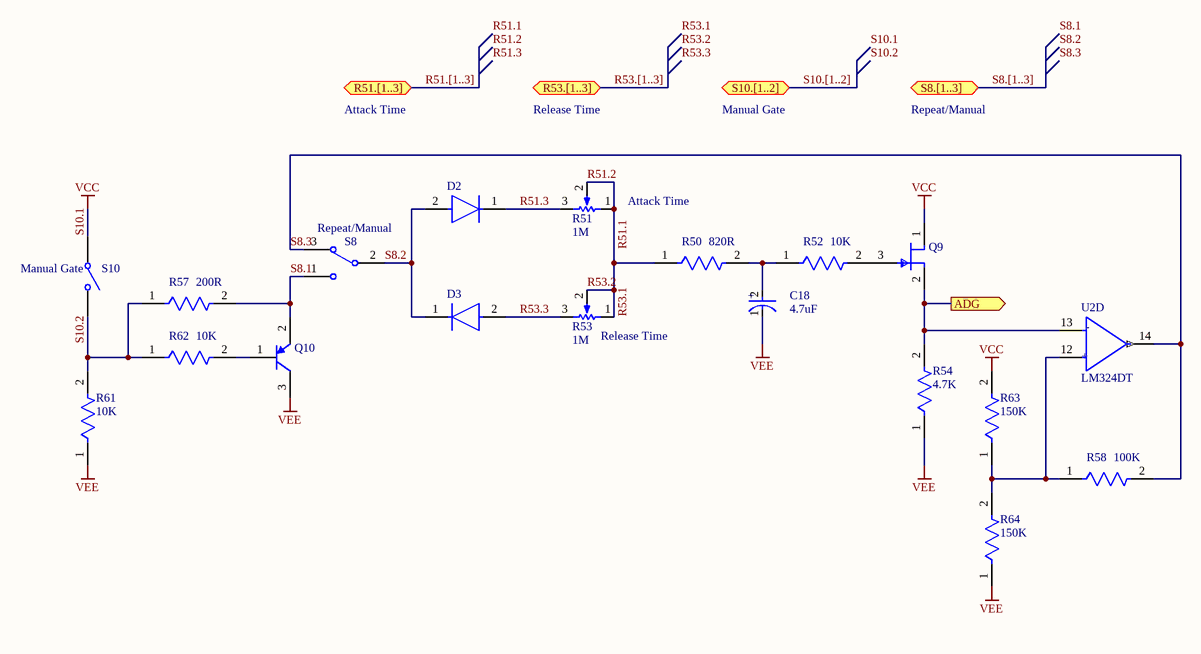
[diagram p4: ADG.SchDoc]

### Parts
C18  Capacitance: 4.7uF  [FP-OS-CON-SMT-A5-MFG]
D2  1N4448WS-7-F  [FP-SOD323-MFG]  (value not drawn)
D3  1N4448WS-7-F  [FP-SOD323-MFG]  (value not drawn)
Q9  MMBFJ113  [FP-318BM-IPC_C]  (value not drawn)
Q10  MMBT3906LT1G  [ONSC-SOT-23-3-318-08_V]  (value not drawn)
R50  Resistance: 820R  [FP-ESR03-IPC_B]  (hidden comment: ESR03EZPJ821)
R51  Attack Time  value 1M  [VR5]  (graphical)
R52  Resistance: 10K  [FP-ESR03-IPC_B]  (hidden comment: ESR03EZPJ103)
R53  Release Time  value 1M  [VR5]  (graphical)
R54  Resistance: 4.7K  [FP-ESR03-IPC_B]  (hidden comment: ESR03EZPJ472)
R57  Resistance: 200R  [FP-ESR03-IPC_B]  (hidden comment: ESR03EZPJ201)
R58  Resistance: 100K  [FP-ESR03-IPC_B]  (hidden comment: ESR03EZPJ104)
R61  Resistance: 10K  [FP-ESR03-IPC_B]  (hidden comment: ESR03EZPJ103)
R62  Resistance: 10K  [FP-ESR03-IPC_B]  (hidden comment: ESR03EZPJ103)
R63  Resistance: 150K  [FP-ESR03-IPC_B]  (hidden comment: ESR03EZPJ154)
R64  Resistance: 150K  [FP-ESR03-IPC_B]  (hidden comment: ESR03EZPJ154)
S8  Repeat/Manual  [HDR1X3]  (graphical)
S10  Manual Gate  [HDR1X2]  (graphical)
U2  LM324DT  [FP-SO-14-MFG]  (part D of 4)

### Ports
ADG (out), R51.[1..3] (bidir), R53.[1..3] (bidir), S8.[1..3] (bidir), S10.[1..2] (bidir)

### Nets
VCC: Q9.1(D) R63.2 S10.1(COMMON)  [also labelled S10.1]
VEE: C18.1(C) Q10.3(C) R54.1 R61.1 R64.1
ADG: Q9.2(S) R54.2 U2.13(Inverting_Input_4) ; port ADG
R51.1: R50.1 R51.1(TOP) R51.2(TAP) R53.1(TOP) R53.2(TAP)  [also labelled R51.2, R53.1, R53.2]
R51.3: D2.1(C) R51.3(BOT)
R53.3: D3.2(A) R53.3(BOT)
S8.1: Q10.2(E) R57.2 S8.1
S8.2: D2.2(A) D3.1(C) S8.2
S8.3: R58.2 S8.3 U2.14(Output_4)
S10.2: R57.1 R61.2 R62.1 S10.2(NO)
NetC18_2: C18.2(A) R50.2 R52.1
NetQ9_3: Q9.3(G) R52.2
NetQ10_1: Q10.1(B) R62.2
NetR58_1: R58.1 R63.1 R64.2 U2.12(Non-Inverting_Input_4)

### Buses and harness runs
bus R51.[1..3] = port R51.[1..3]
bus R53.[1..3] = port R53.[1..3]
bus S8.[1..3] = port S8.[1..3]
bus S10.[1..2] = port S10.[1..2]

### Notes on the sheet
- Attack Time
- Release Time
- Manual Gate
- Repeat/Manual
- Labels drawn without touching a wire or pin: R51.1, R51.2, R51.3, R53.1, R53.2, R53.3, S8.1, S8.2, S8.3, S10.1, S10.2
- (in symbol CMP-05427-000158-1) +
- (in symbol CMP-12131-000005-1, part D) -; +

### Library data of the parts
C18 = CMP-05427-000158-1: Manufacturer: Wurth Electronics; Manufacturer Part Number: 865080640004; Material: Aluminium; Tolerance: 20%; Voltage Rating: 50V; Polarity: Polar; Ripple Current: 55mA; Impedance: 4.5R; Life (Hours): 2000Hour; Supplier 1: RSComponents; Supplier Part Number 1: 8391865; RoHS: Yes; Category: Aluminum Electrolytic Capacitors; Stock 1: 1; Pricing 1: 25=0.18500, 125=0.12700, 250=0.11600, 500=0.10400, 2500=0.09800 (USD); Mount: Surface Mount; Case/Package: Radial; Min Operating Temperature: -55°C; Max Operating Temperature: 105°C; Package Quantity: 1; Packaging: Cut Tape; Ripple Current (AC): 55mA; Voltage Rating (DC): 50V; Diameter: 4mm; Height: 5.5mm; Height - Seated (Max): 0.217inch; REACH SVHC: Unknown; RoHS Compliant: Yes; ComponentLink1URL: https://datasheet.ciiva.com/48693/001280472-da-01-en-wcap-asli-alu-elec-caps-865080640004-48693547.pdf?src-supplier=Conrad; ComponentLink1Description: https://datasheet.ciiva.com/48693/001280472-da-01-en-wcap-asli-alu-elec-caps-865080640004-48693547.pdf?src-supplier=Conrad
D2 D3 = CMP-12791-000011-1: DIODE GEN PURP 75V 250MA SOD323; Manufacturer: Diodes Incorporated; Forward Current: 500mA; Max Junction Temp: +150°C; Max Surge Forward Current: 0.5A; Value: 4pF; Peak Reverse Current: 2.5uA; Standoff Height: 0.05mm; ComponentLink2URL: https://www.diodes.com/assets/Datasheets/ds30096.pdf; ComponentLink2Description: Datasheet; Automotive: No; Temperature Range Low: -65°C; Package: SOD323; Temperature Range High: +150°C; Device Class L3: Rectifier Diodes; Reverse Voltage: 75V; Device Class L2: Diodes; Max Repetitive Reverse Voltage: 75V; Manufacturer Part Number: 1N4448WS-7-F; RoHS: TRUE; Lead Free: Yes; Temperature: -65°C to +150°C; Mouser Description: 1N4448WS Series 4 A 75 V 200 mW Surface Mount Fast Switching Diode - SOD-323; Capacitance: 4pF; Height: 1.2mm; Digikey Description: DIODE GEN PURP 75V 250MA SOD323; Octopart: https://octopart.com/1n4448ws-7-f-diodes+inc.-55389585; Footprint Url: https://www.diodes.com/assets/Package-Files/SOD323.pdf; Device Class L1: Discrete Semiconductors; Category: Diode
Q9 = CMP-07172-000001-1: JFET N-CH 35V 350MW SOT23; Manufacturer: ON Semiconductor; Number Of N Channels: 1; Gate To Source Voltage: -35V; Drain To Source Resistance: 100Ω; Standoff Height: 0mm; Rthja Max: 357°C/W; Max Junction Temp: +150°C; Gate to Source Voltage (Vgs): -25V; Element Configuration: Single; Input Capacitance: 7pF; Drain to Source Voltage (Vdss): 25V; Continuous Drain Current (ID): 5mA; Current Rating: 10mA; Polarity: N-CHANNEL; Device Class L2: Transistors; Number Of Channels: 1; ComponentLink2Description: Datasheet; Device Class L3: JFETs; Device Class L1: Discrete Semiconductors; Lead Free: Yes; Power Dissipation: 350mW; Category: Trans; Mouser Description: JFET N-Channel Switch; ComponentLink2URL: https://www.onsemi.com/pub/Collateral/MMBFJ113-D.PDF; RoHS: TRUE; Footprint Url: https://www.onsemi.com/pub/Collateral/318BM.PDF; Height: 1.2mm; Package: 318BM; Temperature Range High: +150°C; Manufacturer Part Number: MMBFJ113; Temperature: -55°C to +150°C; Digikey Description: JFET N-CH 35V 350MW SOT23; Temperature Range Low: -55°C; Octopart: https://octopart.com/mmbfj113-on+semiconductor-84330253; Automotive: No; Ipc Land Pattern Name: SOT95P240X120-3; Supplier 1: Digi-Key; Supplier Part Number 1: MMBF5457CT-ND; Stock 1: 13304; Pricing 1: 1=0.50000, 10=0.39000, 25=0.37280, 100=0.23400, 500=0.21670, 1000=0.14736 (USD); Mount: Surface Mount; Case/Package: SOT-23; Number of Pins: 3; Weight: 0.03g; Contact Plating: Tin,Matte; Min Operating Temperature: -55°C; Max Operating Temperature: 150°C; Packaging: Tape and Reel; Package Quantity: 1; Max Power Dissipation: 350mW; Voltage Rating (DC): 25V; Series: MMBF5457; Length: 2.92mm; Width: 1.3mm; Radiation Hardening: No; RoHS Compliant: Yes; REACH SVHC: No SVHC; ComponentLink1URL: https://datasheet.ciiva.com/25625/0900766b810cdc04-25625787.pdf?src-supplier=RSComponents; ComponentLink1Description: https://datasheet.ciiva.com/25625/0900766b810cdc04-25625787.pdf?src-supplier=RSComponents; ComponentLink3URL: https://datasheet.ciiva.com/8120/mmbf5459-8120391.pdf?src-supplier=Avnet; ComponentLink3Description: https://datasheet.ciiva.com/8120/mmbf5459-8120391.pdf?src-supplier=Avnet; ComponentLink4URL: https://datasheet.ciiva.com/26026/mmbf5459-26026568.pdf?src-supplier=Avnet+Europe; ComponentLink4Description: https://datasheet.ciiva.com/26026/mmbf5459-26026568.pdf?src-supplier=Avnet+Europe; ComponentLink5URL: https://datasheet.ciiva.com/960/mmbf5457-960906.pdf?src-supplier=Digi-Key; ComponentLink5Description: https://datasheet.ciiva.com/960/mmbf5457-960906.pdf?src-supplier=Digi-Key; ComponentLink6URL: https://datasheet.ciiva.com/960/mmbf5457-960907.pdf?src-supplier=Digi-Key; ComponentLink6Description: https://datasheet.ciiva.com/960/mmbf5457-960907.pdf?src-supplier=Digi-Key; ComponentLink7URL: https://datasheet.ciiva.com/46445/46943-46445739.pdf?src-supplier=Element14; ComponentLink7Description: https://datasheet.ciiva.com/46445/46943-46445739.pdf?src-supplier=Element14; ComponentLink8URL: https://datasheet.ciiva.com/960/mmbf5457-960908.pdf?src-supplier=Digi-Key; ComponentLink8Description: https://datasheet.ciiva.com/960/mmbf5457-960908.pdf?src-supplier=Digi-Key; ComponentLink9URL: https://datasheet.ciiva.com/3304/mmbf5459-3304349.pdf?src-supplier=Avnet; ComponentLink9Description: https://datasheet.ciiva.com/3304/mmbf5459-3304349.pdf?src-supplier=Avnet
Q10 = CMP-1048-00670-1: General Purpose Transistor, PNP Silicon, 3-Pin SOT-23, Pb-Free, Tape and Reel; Manufacturer: On Semiconductor; IC Continuous (A): -0.2; fT Min (MHz): 250; PackageDescription: 3-Pin Small Outline Transistor, Body 2.92 x 1.3 mm, Pitch 0.95 mm; PartNumber: MMBT3906LT1G; Packing: Tape and Reel; ComponentLink3Description: Package Specification; Mounting Technology: Surface Mount; ComponentLink3URL: http://www.onsemi.cn/pub_link/Collateral/318-08.PDF; ComponentLink1URL: http://www.onsemi.com/; ComponentLink2URL: http://www.onsemi.cn/pub_link/Collateral/MMBT3906LT1-D.PDF; PackageReference: SOT-23-3-318-08; Polarity: PNP; ComponentLink2Description: Datasheet; PackageVersion: Rev. AP, 11/2009; RoHS: TRUE; DatasheetVersion: Rev. 11; ComponentLink1Description: Manufacturer URL
R50 = CMP-08839-006118-1: 820Ω ±5% 0.25W 0603 Anti-Surge Chip Resistor AEC-Q200; Temperature Coefficient: 200ppm/°C; Max Power Dissipation: 250mW; Length: 0.063inch; Tolerance: 5%; Height: 0.022inch; Case Code (Imperial): 0603; Case/Package: 0603; Features: Automotive AEC-Q200; Resistor Type: Thick Film; Case Code (Metric): 1608; Max Operating Temperature: 155°C; Package Quantity: 5000; Min Operating Temperature: -55°C; Series: ESR; Number of Terminations: 2; Width: 0.031inch; Packaging: Cut Tape; RoHS Compliant: Yes
R51 R53 = RPot: as R49 on sheet LFO; Published: 8-Jun-2000; LatestRevisionDate: 17-Jul-2002; LatestRevisionNote: Re-released for DXP Platform.; PackageReference: VR5; Publisher: Altium Limited; PackageDescription: Variable Resistor, Thru-Hole; 3 Leads
R52 R61 R62 = CMP-08839-028975-1: as R9 on sheet White Noise; Tolerance: 5%; Series: ESR03; Package Quantity: 5000; Length: 0.063inch; Height: 0.022inch; Lead Free: Lead Free; Case/Package: 0603; Case Code (Metric): 1608; Width: 0.031inch; Resistor Type: Thick Film; Max Power Dissipation: 250mW; Packaging: Tape and Reel; Mount: Surface Mount; Number of Terminations: 2; Case Code (Imperial): 0603; Max Operating Temperature: 155°C; Min Operating Temperature: -55°C; RoHS Compliant: Yes
R54 = CMP-08839-007853-1: as R37 on sheet Power Supply; Packaging: Tape and Reel; Series: ESR; Height: 0.022inch; Case Code (Imperial): 0603; Tolerance: 5%; RoHS Compliant: Yes; Case/Package: 0603; Min Operating Temperature: -55°C; Resistor Type: Thick Film; Package Quantity: 5000; Features: Automotive AEC-Q200; Width: 0.031inch; Length: 0.063inch; Max Operating Temperature: 155°C; Number of Terminations: 2
R57 = CMP-08839-005791-1: 200Ω ±5% 0.25W 0603 Anti-Surge Chip Resistor AEC-Q200; Max Power Dissipation: 250mW; Temperature Coefficient: 200ppm/°C; Number of Terminations: 2; Packaging: Tape and Reel; Width: 0.031inch; Features: Automotive AEC-Q200; Max Operating Temperature: 155°C; Case Code (Metric): 1608; Series: ESR; Package Quantity: 5000; Case/Package: 0603; Height: 0.022inch; Tolerance: 5%; Min Operating Temperature: -55°C; Case Code (Imperial): 0603; RoHS Compliant: Yes; Resistor Type: Thick Film; Length: 0.063inch
R58 = CMP-08839-029521-1: as R25 on sheet White Noise; Length: 0.063inch; Case Code (Imperial): 0603; Case/Package: 0603; Resistor Type: Thick Film; Features: Automotive AEC-Q200; Package Quantity: 1; Width: 0.031inch; Packaging: Cut Tape; Min Operating Temperature: -55°C; Series: ESR; RoHS Compliant: Yes; Size Code: 0603; Tolerance: 5%; Height: 0.022inch; Max Operating Temperature: 155°C; Lead Free: Lead Free; Case Code (Metric): 1608; Number of Terminations: 2
R63 R64 = CMP-08839-028438-1: 150kΩ ±5% 0.25W 0603 Anti-Surge Chip Resistor AEC-Q200; Temperature Coefficient: 200ppm/°C; Max Power Dissipation: 250mW; Case Code (Metric): 1608; Packaging: Cut Tape; Min Operating Temperature: -55°C; Number of Terminations: 2; Package Quantity: 1; Case Code (Imperial): 0603; Series: ESR; Width: 0.031inch; Tolerance: 5%; Length: 0.063inch; Resistor Type: Thick Film; Case/Package: 0603; Max Operating Temperature: 155°C; Height: 0.022inch; RoHS Compliant: Yes; Features: Automotive AEC-Q200
S8 = SW-SPDT: as S11 on sheet Power Supply; Supplier 1: Newark; Supplier Part Number 1: 15N9971; RoHS: Yes; Category: Toggle Switches; Stock 1: 978; Pricing 1: 1=3.08000, 10=2.76000, 25=2.61000, 50=2.49000, 100=2.37000 (USD); Mount: Panel; Contact Material: Copper Alloy,Silver; Contact Plating: Silver; Housing Material: Stainless Steel; Min Operating Temperature: -30°C; Max Operating Temperature: 85°C; Throw Configuration: SPDT; Current Rating: 5A; Package Quantity: 1; Packaging: Bulk; Max Voltage Rating (DC): 28V; Termination: Solder; Orientation: Straight; Series: 100; REACH SVHC: No SVHC; Lead Free: Lead Free; RoHS Compliant: Yes; ComponentLink1URL: https://datasheet.ciiva.com/2904/st110007c-2904798.pdf?src-supplier=Digi-Key; ComponentLink1Description: https://datasheet.ciiva.com/2904/st110007c-2904798.pdf?src-supplier=Digi-Key; ComponentLink2URL: https://datasheet.ciiva.com/16154/xt0157p-16154561.pdf?src-supplier=Onlinecomponents.com; ComponentLink2Description: https://datasheet.ciiva.com/16154/xt0157p-16154561.pdf?src-supplier=Onlinecomponents.com; ComponentLink3URL: https://datasheet.ciiva.com/16347/100-16347391.pdf?src-supplier=Future+Electronics; ComponentLink3Description: https://datasheet.ciiva.com/16347/100-16347391.pdf?src-supplier=Future+Electronics
S10 = SW-SPST: Pushbutton Switch, SPST-NO, OFF-(ON), Round Red Cap, 3A, 125VAC, Solder, PS1024 Series; Manufacturer: E-Switch; Manufacturer Part Number: PS1024ARED; Mechanical Life: 6000Cycles; Voltage Rating (AC): 125V; Throw Configuration: SPST; Contact Resistance: 50mR; Max Voltage Rating (AC): 250V; Switch Function: Off-Mom; Actuator Type: Round, Button; Life (Hours): 6000Hour; Thread Size: M7; Actuator Length: 8.6mm; Supplier 1: Newark; Supplier Part Number 1: 15N8448; RoHS: Yes; Category: Pushbutton Switches; Stock 1: 744; Pricing 1: 1=1.71000, 10=1.54000, 25=1.45000, 50=1.38000, 100=1.32000, 250=1.26000 (USD); Mount: Bushing,Panel; Actuator Color: Red; Min Operating Temperature: -20°C; Max Operating Temperature: 65°C; Current Rating: 3A; Termination: Solder; Series: PS1024; Packaging: Bulk; Package Quantity: 1; Life (Cycles): 6000Cycles; Electrical Life: 6000Cycles; Orientation: Straight; Diameter: 6.1mm; Lead Free: Lead Free; RoHS Compliant: Yes; ComponentLink1URL: https://datasheet.ciiva.com/2870/ps1024ared-2870125.pdf?src-supplier=Digi-Key; ComponentLink1Description: https://datasheet.ciiva.com/2870/ps1024ared-2870125.pdf?src-supplier=Digi-Key; ComponentLink2URL: https://datasheet.ciiva.com/16293/ps1024ared-16293422.pdf?src-supplier=Future+Electronics; ComponentLink2Description: https://datasheet.ciiva.com/16293/ps1024ared-16293422.pdf?src-supplier=Future+Electronics
U2 = CMP-12131-000005-1: as U2 on sheet LFO; Device Class L1: Integrated Circuits (ICs); Device Class L3: Amplifiers - Op Amps; Temperature Range Low: 0°C; Package: SO-14; Temperature Range High: +70°C; Digikey Description: IC OPAMP GP 4 CIRCUIT 14SO; Device Class L2: Linear ICs; Footprint Url: https://www.st.com/content/ccc/resource/technical/document/datasheet/group3/10/8a/e6/12/f8/e8/49/ce/DM00366438/files/DM00366438.pdf/jcr:content/translations/en.DM00366438.pdf; Octopart: https://octopart.com/lm324dt-stmicroelectronics-39579146; ComponentLink2URL: https://www.st.com/content/ccc/resource/technical/document/datasheet/bd/fc/46/43/26/8f/40/7f/CD00001046.pdf/files/CD00001046.pdf/jcr:content/translations/en.CD00001046.pdf; ComponentLink2Description: Datasheet; Lead Free: Yes; Temperature: 0°C to +70°C; RoHS: TRUE; Gain Bandwidth: 1.3MHz; Manufacturer Part Number: LM324DT; Automotive: No; Category: IC; Height: 1.75mm; Mouser Description: LM324 Series 32 V 1.3 MHz Low Power Quad Operational Amplifier - SOIC-14